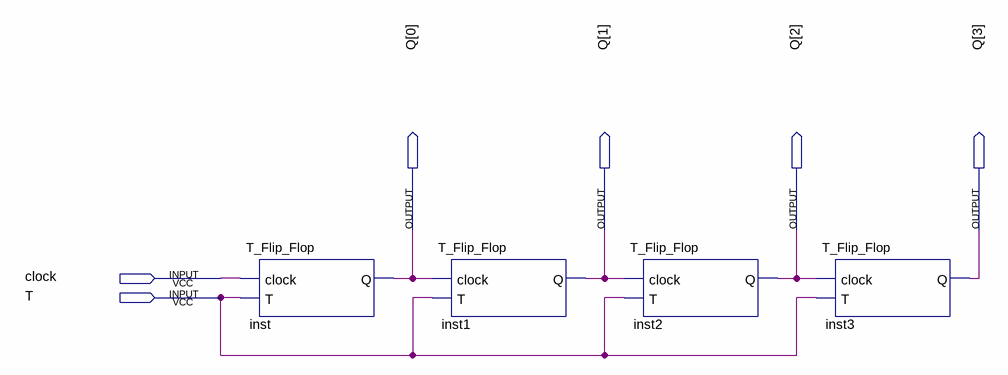
[diagram p0: schematic sheet]
// Quartus schematic binary_ripple_counter_4bit.bdf as structural Verilog: 4 symbols, 6 pins
module binary_ripple_counter_4bit (
  input  clock,
  input  T,
  output [3:0] Q
);

  T_Flip_Flop inst (.clock(clock), .T(T), .Q(Q[0]));
  T_Flip_Flop inst1 (.clock(Q[0]), .T(T), .Q(Q[1]));
  T_Flip_Flop inst2 (.clock(Q[1]), .T(T), .Q(Q[2]));
  T_Flip_Flop inst3 (.clock(Q[2]), .T(T), .Q(Q[3]));
endmodule
